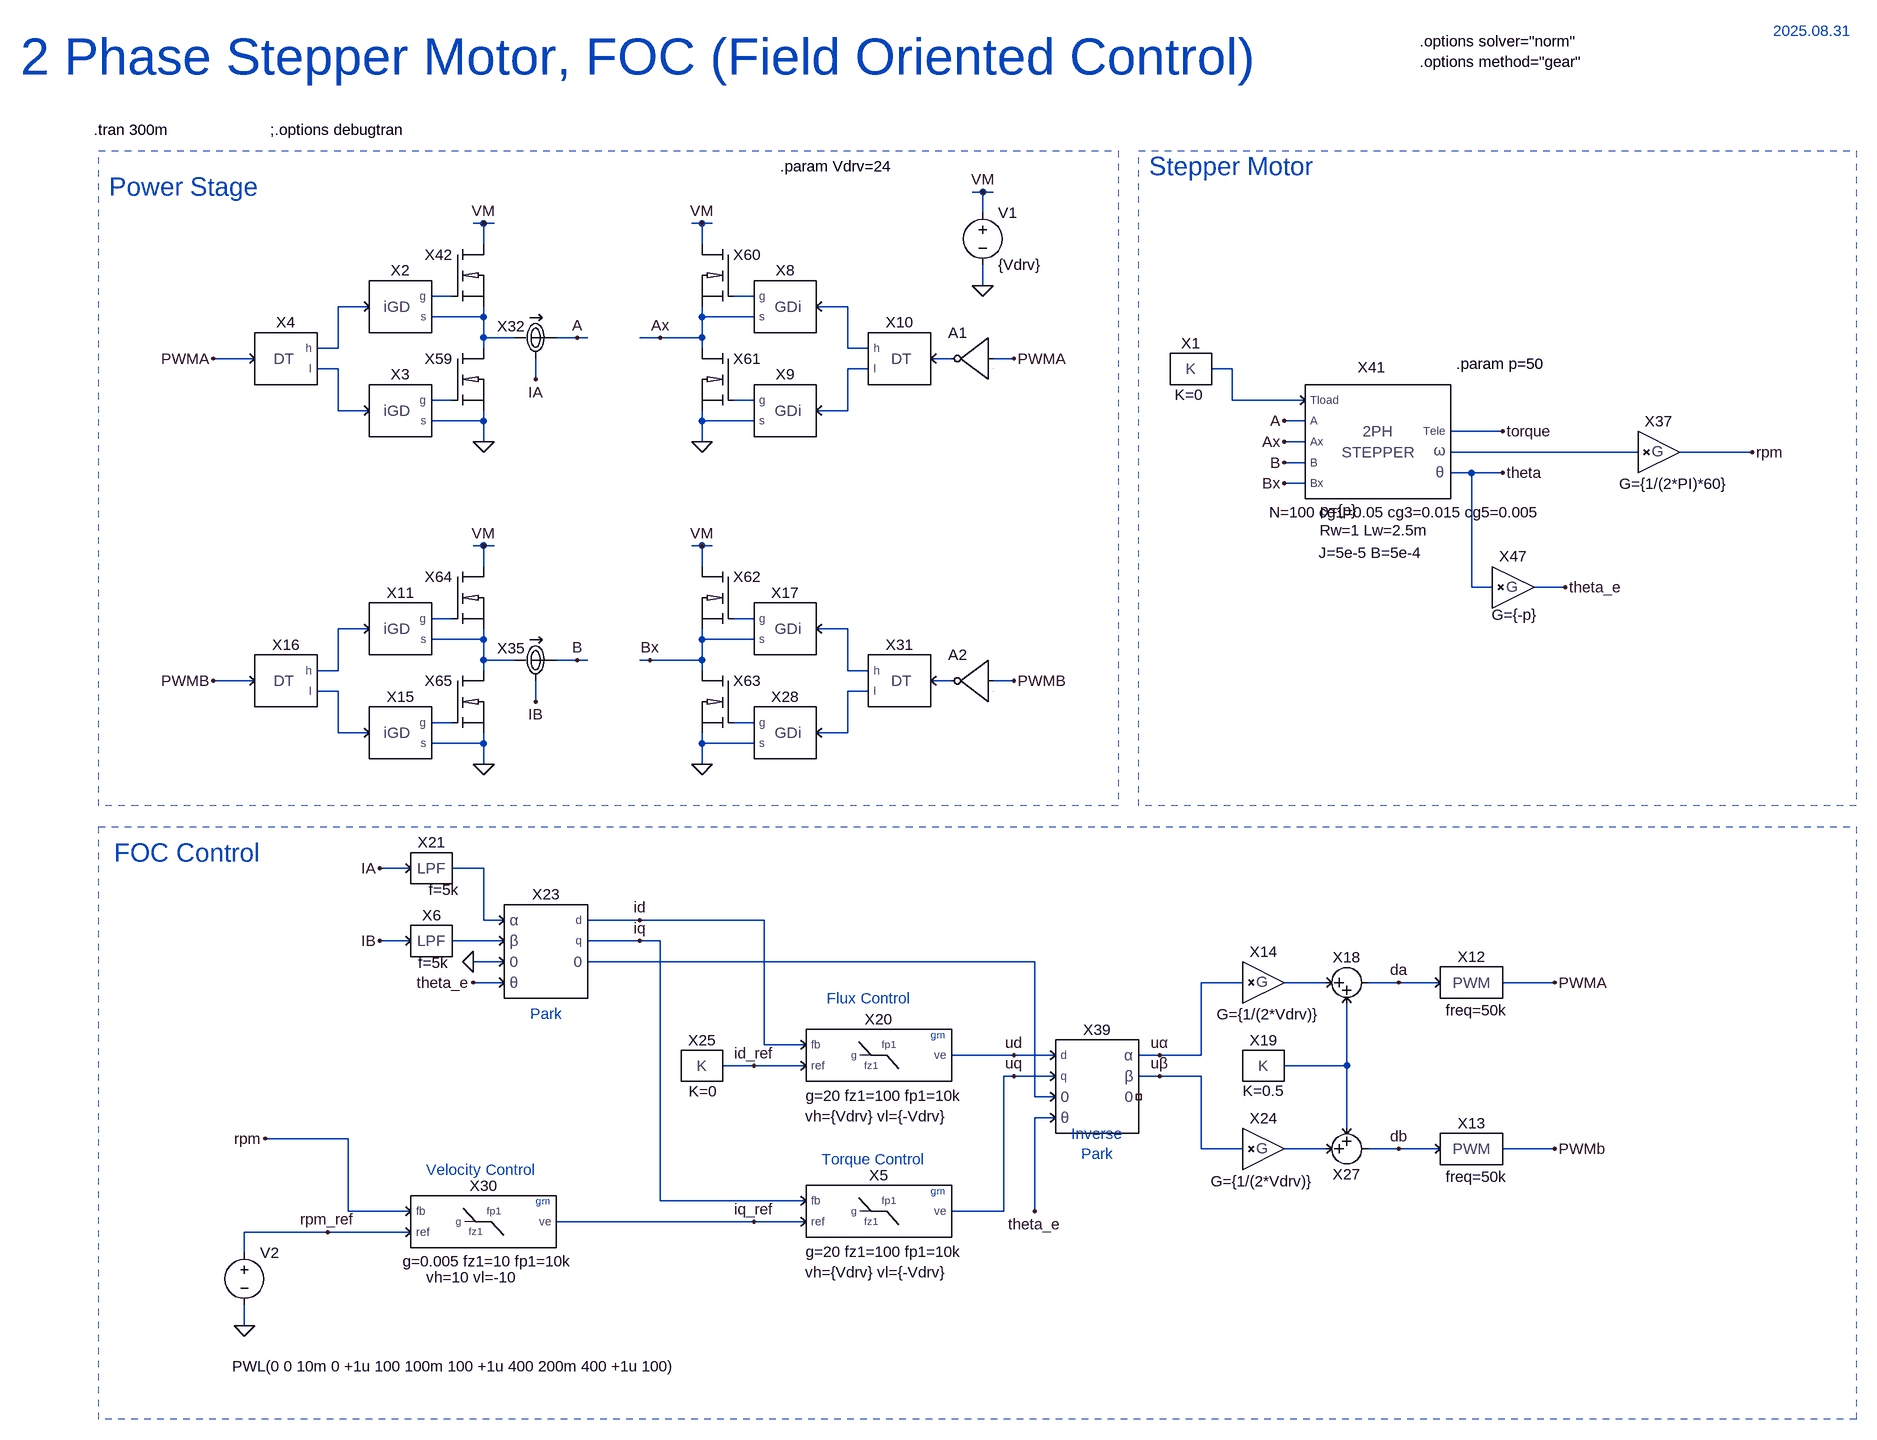
[diagram p0: schematic STEP2PH_FOC.asc]
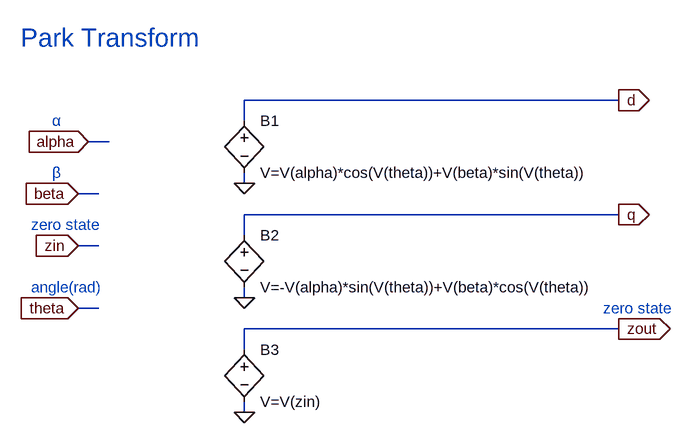
[diagram p1: sub-circuit park.asc]
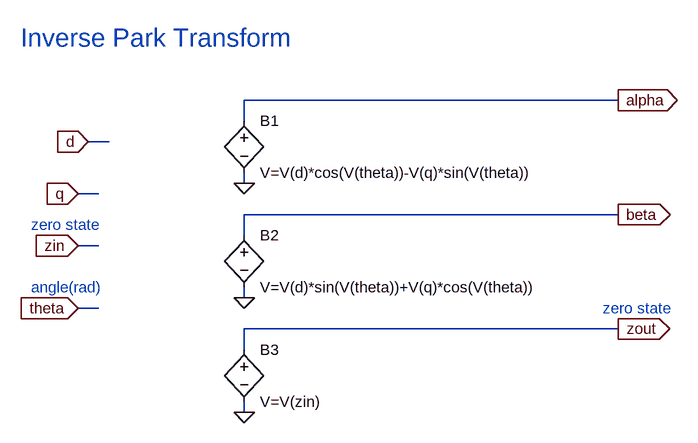
[diagram p2: sub-circuit parkinv.asc]
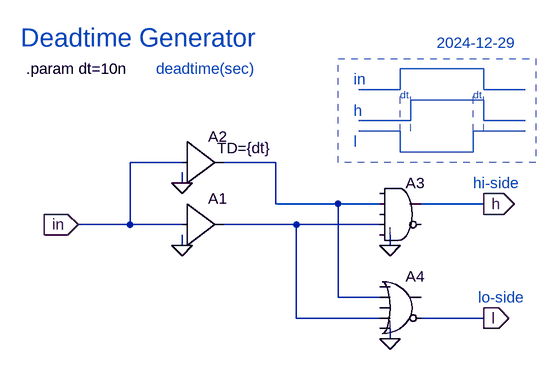
[diagram p3: sub-circuit deadtime.asc]
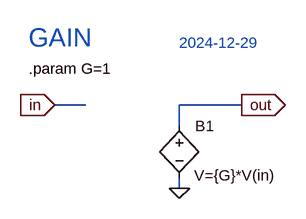
[diagram p4: sub-circuit gain.asc]
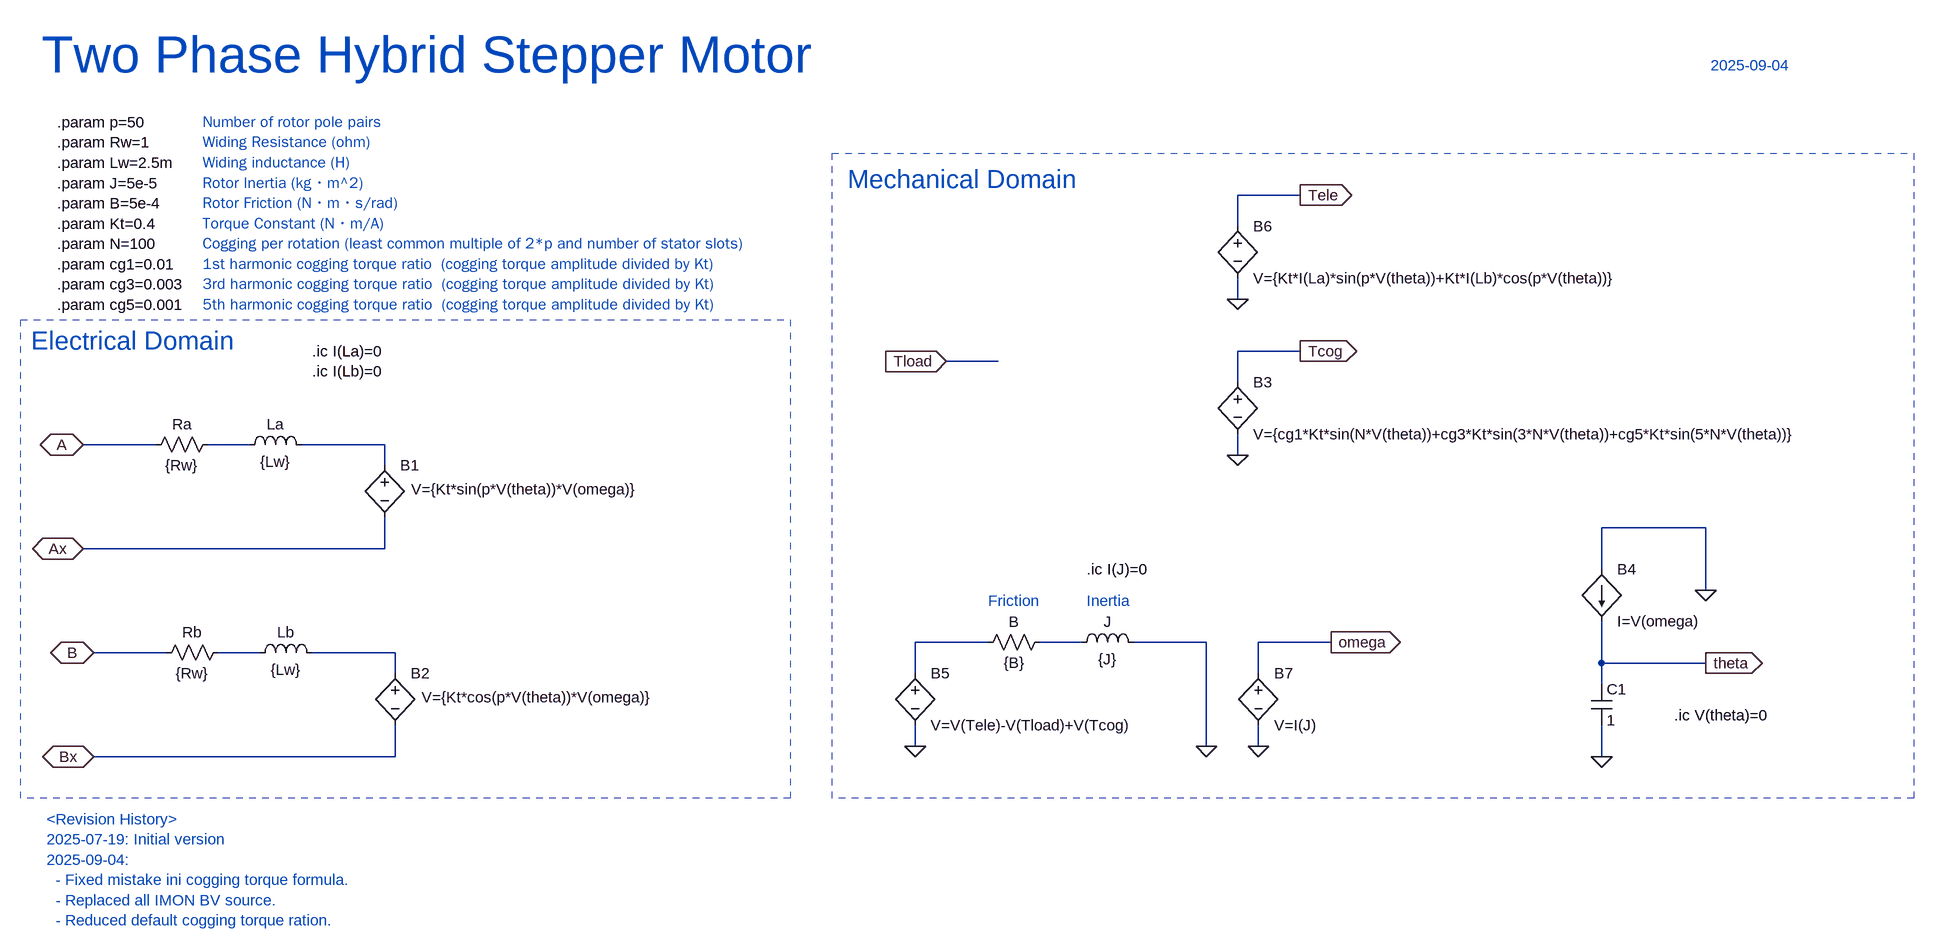
[diagram p5: sub-circuit stepper_2ph.asc]
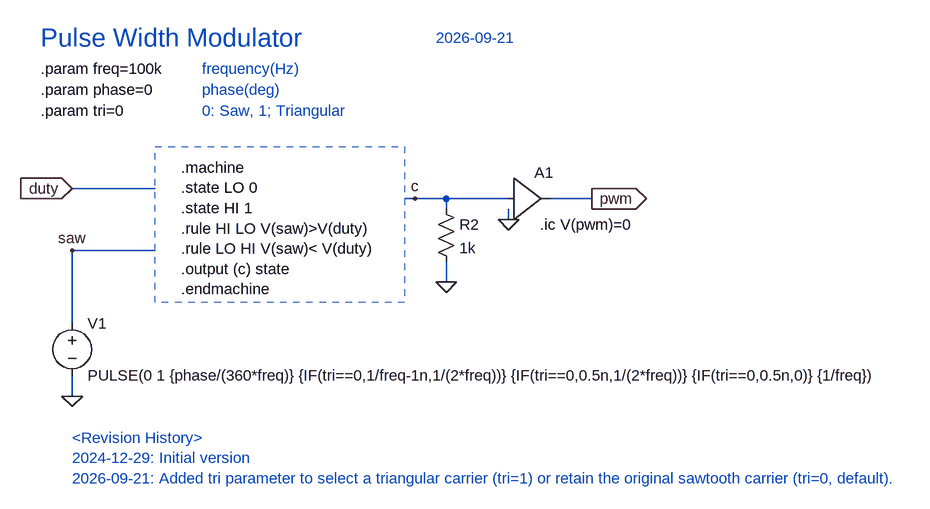
[diagram p6: sub-circuit pwm.asc]
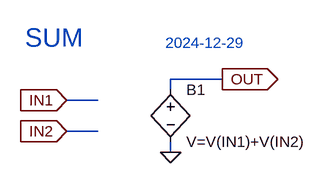
[diagram p7: sub-circuit sum.asc]
STEP2PH_FOC.asc, the LTspice schematic file:
Version 4.1
SHEET 1 5204 2604
WIRE 3856 -144 3840 -144
WIRE 3872 -144 3856 -144
WIRE 3856 -112 3856 -144
WIRE 3088 -96 3072 -96
WIRE 3104 -96 3088 -96
WIRE 3424 -96 3408 -96
WIRE 3440 -96 3424 -96
WIRE 3088 -64 3088 -96
WIRE 3424 -64 3424 -96
WIRE 3856 0 3856 -32
WIRE 3040 16 3008 16
WIRE 3504 16 3472 16
WIRE 2912 32 2864 32
WIRE 3648 32 3600 32
WIRE 3088 48 3088 32
WIRE 3088 48 3008 48
WIRE 3424 48 3424 32
WIRE 3504 48 3424 48
WIRE 3088 80 3088 48
WIRE 3136 80 3088 80
WIRE 3232 80 3200 80
WIRE 3248 80 3232 80
WIRE 3360 80 3328 80
WIRE 3424 80 3424 48
WIRE 3424 80 3360 80
WIRE 2864 96 2864 32
WIRE 2864 96 2832 96
WIRE 3088 96 3088 80
WIRE 3424 96 3424 80
WIRE 3648 96 3648 32
WIRE 3680 96 3648 96
WIRE 2736 112 2672 112
WIRE 3808 112 3776 112
WIRE 3904 112 3872 112
WIRE 2864 128 2832 128
WIRE 3680 128 3648 128
WIRE 4240 128 4208 128
WIRE 3168 144 3168 112
WIRE 3040 176 3008 176
WIRE 3504 176 3472 176
WIRE 4240 176 4240 128
WIRE 4352 176 4240 176
WIRE 2864 192 2864 128
WIRE 2912 192 2864 192
WIRE 3648 192 3648 128
WIRE 3648 192 3600 192
WIRE 3088 208 3088 192
WIRE 3088 208 3008 208
WIRE 3424 208 3424 192
WIRE 3504 208 3424 208
WIRE 4352 208 4320 208
WIRE 4656 224 4576 224
WIRE 3088 240 3088 208
WIRE 3424 240 3424 208
WIRE 4352 240 4320 240
WIRE 4864 256 4576 256
WIRE 5040 256 4928 256
WIRE 4352 272 4320 272
WIRE 4608 288 4576 288
WIRE 4656 288 4608 288
WIRE 4352 304 4320 304
WIRE 3088 400 3072 400
WIRE 3104 400 3088 400
WIRE 3424 400 3408 400
WIRE 3440 400 3424 400
WIRE 3088 432 3088 400
WIRE 3424 432 3424 400
WIRE 4608 464 4608 288
WIRE 4640 464 4608 464
WIRE 4752 464 4704 464
WIRE 3040 512 3008 512
WIRE 3504 512 3472 512
WIRE 2912 528 2864 528
WIRE 3648 528 3600 528
WIRE 3088 544 3088 528
WIRE 3088 544 3008 544
WIRE 3424 544 3424 528
WIRE 3504 544 3424 544
WIRE 3088 576 3088 544
WIRE 3136 576 3088 576
WIRE 3232 576 3200 576
WIRE 3248 576 3232 576
WIRE 3344 576 3328 576
WIRE 3424 576 3424 544
WIRE 3424 576 3344 576
WIRE 2864 592 2864 528
WIRE 2864 592 2832 592
WIRE 3088 592 3088 576
WIRE 3424 592 3424 576
WIRE 3648 592 3648 528
WIRE 3680 592 3648 592
WIRE 2736 608 2672 608
WIRE 3808 608 3776 608
WIRE 3904 608 3872 608
WIRE 2864 624 2832 624
WIRE 3680 624 3648 624
WIRE 3168 640 3168 608
WIRE 3040 672 3008 672
WIRE 3504 672 3472 672
WIRE 2864 688 2864 624
WIRE 2912 688 2864 688
WIRE 3648 688 3648 624
WIRE 3648 688 3600 688
WIRE 3088 704 3088 688
WIRE 3088 704 3008 704
WIRE 3424 704 3424 688
WIRE 3504 704 3424 704
WIRE 3088 736 3088 704
WIRE 3424 736 3424 704
WIRE 2976 896 2928 896
WIRE 3088 896 3040 896
WIRE 3088 976 3088 896
WIRE 3120 976 3088 976
WIRE 3328 976 3248 976
WIRE 3520 976 3328 976
WIRE 2976 1008 2928 1008
WIRE 3120 1008 3040 1008
WIRE 3328 1008 3248 1008
WIRE 3360 1008 3328 1008
WIRE 3120 1040 3072 1040
WIRE 3936 1040 3248 1040
WIRE 3120 1072 3072 1072
WIRE 4256 1072 4192 1072
WIRE 4384 1072 4320 1072
WIRE 4496 1072 4448 1072
WIRE 4560 1072 4496 1072
WIRE 4736 1072 4656 1072
WIRE 3520 1168 3520 976
WIRE 3584 1168 3520 1168
WIRE 3904 1184 3808 1184
WIRE 3968 1184 3904 1184
WIRE 4128 1184 4096 1184
WIRE 4192 1184 4192 1072
WIRE 4192 1184 4128 1184
WIRE 3504 1200 3456 1200
WIRE 3584 1200 3504 1200
WIRE 4416 1200 4416 1104
WIRE 4416 1200 4320 1200
WIRE 3904 1216 3888 1216
WIRE 3968 1216 3904 1216
WIRE 4128 1216 4096 1216
WIRE 4192 1216 4128 1216
WIRE 3936 1248 3936 1040
WIRE 3968 1248 3936 1248
WIRE 3968 1280 3936 1280
WIRE 4416 1296 4416 1200
WIRE 2880 1312 2752 1312
WIRE 4192 1328 4192 1216
WIRE 4256 1328 4192 1328
WIRE 4384 1328 4320 1328
WIRE 4496 1328 4448 1328
WIRE 4560 1328 4496 1328
WIRE 4736 1328 4656 1328
WIRE 3360 1408 3360 1008
WIRE 3584 1408 3360 1408
WIRE 2880 1424 2880 1312
WIRE 2976 1424 2880 1424
WIRE 3888 1424 3888 1216
WIRE 3888 1424 3808 1424
WIRE 3936 1424 3936 1280
WIRE 3504 1440 3200 1440
WIRE 3584 1440 3504 1440
WIRE 2848 1456 2720 1456
WIRE 2976 1456 2848 1456
WIRE 2720 1488 2720 1456
WIRE 2720 1600 2720 1568
FLAG 3504 1200 id_ref
FLAG 3328 976 id
FLAG 3328 1008 iq
FLAG 3072 1072 theta_e
FLAG 3936 1424 theta_e
FLAG 4656 288 theta
FLAG 3088 240 0
FLAG 3232 80 A
FLAG 4320 240 Ax
FLAG 4320 304 Bx
FLAG 3088 -96 VM
FLAG 3424 240 0
FLAG 3360 80 Ax
FLAG 3424 -96 VM
FLAG 2672 112 PWMA
FLAG 3904 112 PWMA
FLAG 4656 224 torque
FLAG 3088 736 0
FLAG 3232 576 B
FLAG 3088 400 VM
FLAG 3424 736 0
FLAG 3344 576 Bx
FLAG 3424 400 VM
FLAG 2672 608 PWMB
FLAG 3904 608 PWMB
FLAG 3856 0 0
FLAG 3856 -144 VM
FLAG 3168 144 IA
FLAG 3168 640 IB
FLAG 4320 208 A
FLAG 4320 272 B
FLAG 5040 256 rpm
FLAG 3072 1040 0
FLAG 2928 896 IA
FLAG 2928 1008 IB
FLAG 4736 1072 PWMA
FLAG 4736 1328 PWMb
FLAG 4128 1184 uα
FLAG 4128 1216 uβ
FLAG 3904 1184 ud
FLAG 3904 1216 uq
FLAG 4752 464 theta_e
FLAG 4496 1072 da
FLAG 4496 1328 db
FLAG 2848 1456 rpm_ref
FLAG 2752 1312 rpm
FLAG 3504 1440 iq_ref
FLAG 2720 1600 0
SYMBOL CONST 3424 1200 R0
WINDOW 39 1 55 Bottom 2
SYMATTR SpiceLine K=0
SYMATTR InstName X25
SYMBOL PowerSim\\PARK 3184 1024 R0
SYMATTR InstName X23
SYMBOL PowerSim\\PARKinv 4032 1232 R0
SYMATTR InstName X39
SYMBOL CONST 4176 128 R0
WINDOW 39 -3 55 Bottom 2
SYMATTR SpiceLine K=0
SYMATTR InstName X1
SYMBOL iGD 2960 32 R0
SYMATTR InstName X2
SYMBOL iGD 2960 192 R0
SYMATTR InstName X3
SYMBOL DEADTIME 2784 112 R0
SYMATTR InstName X4
SYMBOL iGD 3552 32 M0
SYMATTR InstName X8
SYMBOL iGD 3552 192 M0
SYMATTR InstName X9
SYMBOL DEADTIME 3728 112 M0
SYMATTR InstName X10
SYMBOL Digital\\inv 3872 48 M0
WINDOW 3 -21 103 Left 2
SYMATTR InstName A1
SYMBOL iGD 2960 528 R0
SYMATTR InstName X11
SYMBOL iGD 2960 688 R0
SYMATTR InstName X15
SYMBOL DEADTIME 2784 608 R0
SYMATTR InstName X16
SYMBOL iGD 3552 528 M0
SYMATTR InstName X17
SYMBOL iGD 3552 688 M0
SYMATTR InstName X28
SYMBOL DEADTIME 3728 608 M0
SYMATTR InstName X31
SYMBOL voltage 3856 -128 R0
SYMATTR InstName V1
SYMATTR Value {Vdrv}
SYMBOL IMON 3168 80 R0
SYMATTR InstName X32
SYMBOL IMON 3168 576 R0
SYMATTR InstName X35
SYMBOL Digital\\inv 3872 544 M0
WINDOW 3 -21 103 Left 2
SYMATTR InstName A2
SYMBOL GAIN 4896 256 R0
WINDOW 39 23 64 Bottom 2
SYMATTR SpiceLine G={1/(2*PI)*60}
SYMATTR InstName X37
SYMBOL STEPPER_2PH 4464 240 R0
WINDOW 3 -60 121 Bottom 2
WINDOW 123 -6 152 Bottom 2
WINDOW 39 -11 186 Bottom 2
WINDOW 40 43 124 Bottom 2
WINDOW 0 -10 -99 Bottom 2
SYMATTR Value p={p}
SYMATTR InstName X41
SYMBOL iNMOS 3088 -16 R0
SYMATTR InstName X42
SYMBOL iNMOS 3088 144 R0
SYMATTR InstName X59
SYMBOL iNMOS 3424 -16 M0
SYMATTR InstName X60
SYMBOL iNMOS 3424 144 M0
SYMATTR InstName X61
SYMBOL iNMOS 3424 480 M0
SYMATTR InstName X62
SYMBOL iNMOS 3424 640 M0
SYMATTR InstName X63
SYMBOL iNMOS 3088 480 R0
SYMATTR InstName X64
SYMBOL iNMOS 3088 640 R0
SYMATTR InstName X65
SYMBOL GAIN 4672 464 R0
WINDOW 39 3 58 Bottom 2
SYMATTR SpiceLine G={-p}
SYMATTR InstName X47
SYMBOL PWM 4608 1072 R0
WINDOW 39 8 58 Bottom 2
SYMATTR SpiceLine freq=50k
SYMATTR InstName X12
SYMBOL PWM 4608 1328 R0
WINDOW 39 8 58 Bottom 2
SYMATTR SpiceLine freq=50k
SYMATTR InstName X13
SYMBOL GAIN 4288 1072 R0
WINDOW 39 7 64 Bottom 2
SYMATTR SpiceLine G={1/(2*Vdrv)}
SYMATTR InstName X14
SYMBOL SUM 4416 1072 R0
SYMATTR InstName X18
SYMBOL CONST 4288 1200 R0
WINDOW 39 0 54 Bottom 2
SYMATTR SpiceLine K=0.5
SYMATTR InstName X19
SYMBOL GAIN 4288 1328 R0
WINDOW 39 -2 65 Bottom 2
SYMATTR SpiceLine G={1/(2*Vdrv)}
SYMATTR InstName X24
SYMBOL SUM 4416 1328 M180
SYMATTR InstName X27
SYMBOL LPF 3008 896 R0
WINDOW 3 19 49 Bottom 2
SYMATTR Value f=5k
SYMATTR InstName X21
SYMBOL TYPE2_gm 3088 1440 R0
WINDOW 39 7 76 Bottom 2
WINDOW 40 -18 101 Bottom 2
SYMATTR SpiceLine g=0.005 fz1=10 fp1=10k
SYMATTR SpiceLine2 vh=10 vl=-10
SYMATTR InstName X30
SYMBOL TYPE2_gm 3696 1184 R0
WINDOW 39 9 78 Bottom 2
WINDOW 40 -4 109 Bottom 2
SYMATTR SpiceLine g=20 fz1=100 fp1=10k
SYMATTR SpiceLine2 vh={Vdrv} vl={-Vdrv}
SYMATTR InstName X20
SYMBOL TYPE2_gm 3696 1424 R0
WINDOW 39 9 78 Bottom 2
WINDOW 40 -4 109 Bottom 2
SYMATTR SpiceLine g=20 fz1=100 fp1=10k
SYMATTR SpiceLine2 vh={Vdrv} vl={-Vdrv}
SYMATTR InstName X5
SYMBOL voltage 2720 1472 R0
WINDOW 123 0 0 Left 0
WINDOW 39 0 0 Left 0
WINDOW 3 -19 190 Left 2
SYMATTR Value PWL(0 0 10m 0 +1u 100 100m 100 +1u 400 200m 400 +1u 100)
SYMATTR InstName V2
SYMBOL LPF 3008 1008 R0
WINDOW 3 3 49 Bottom 2
SYMATTR Value f=5k
SYMATTR InstName X6
TEXT 3160 1120 Left 2 ;Park
TEXT 4032 1320 Center 2 ;Inverse\nPark
TEXT 2488 -240 Left 2 !.tran 300m
TEXT 4528 -376 Left 2 !.options solver="norm"\n.options method="gear"
TEXT 4584 120 Left 2 !.param p=50
TEXT 2376 -352 Left 6 ;2 Phase Stepper Motor, FOC (Field Oriented Control)
TEXT 4112 -184 Left 4 ;Stepper Motor
TEXT 5072 -392 Left 2 ;2025.08.31
TEXT 2512 -152 Left 4 ;Power Stage
TEXT 3608 1344 Left 2 ;Torque Control
TEXT 3616 1096 Left 2 ;Flux Control
TEXT 2760 -240 Left 2 !;.options debugtran
TEXT 3000 1360 Left 2 ;Velocity Control
TEXT 3544 -184 Left 2 !.param Vdrv=24
TEXT 2520 872 Left 4 ;FOC Control
TEXT 3776 1152 Left 1 ;gm
TEXT 3776 1392 Left 1 ;gm
TEXT 3168 1408 Left 1 ;gm
RECTANGLE Normal 4064 800 2496 -208 2
RECTANGLE Normal 5200 800 4096 -208 2
RECTANGLE Normal 5200 1744 2496 832 2

park.asc, the sub-circuit schematic file:
Version 4
SHEET 1 880 680
WIRE 592 96 16 96
WIRE 16 128 16 96
WIRE -192 160 -224 160
WIRE 16 224 16 208
WIRE -208 240 -240 240
WIRE 592 272 16 272
WIRE 16 304 16 272
WIRE -208 320 -240 320
WIRE 16 400 16 384
WIRE -208 416 -240 416
WIRE 592 448 16 448
WIRE 16 480 16 448
WIRE 16 576 16 560
FLAG 16 224 0
FLAG 592 96 d
IOPIN 592 96 Out
FLAG -224 160 alpha
IOPIN -224 160 In
FLAG -240 320 zin
IOPIN -240 320 In
FLAG 16 400 0
FLAG 592 272 q
IOPIN 592 272 Out
FLAG 16 576 0
FLAG 592 448 zout
IOPIN 592 448 Out
FLAG -240 416 theta
IOPIN -240 416 In
FLAG -240 240 beta
IOPIN -240 240 In
SYMBOL bv 16 112 R0
SYMATTR InstName B1
SYMATTR Value V=V(alpha)*cos(V(theta))+V(beta)*sin(V(theta))
SYMBOL bv 16 288 R0
SYMATTR InstName B2
SYMATTR Value V=-V(alpha)*sin(V(theta))+V(beta)*cos(V(theta))
SYMBOL bv 16 464 R0
SYMATTR InstName B3
SYMATTR Value V=V(zin)
TEXT -328 0 Left 4 ;Park Transform
TEXT -280 128 Left 2 ;α
TEXT -280 208 Left 2 ;β
TEXT -312 288 Left 2 ;zero state
TEXT -312 384 Left 2 ;angle(rad)
TEXT 568 416 Left 2 ;zero state

parkinv.asc, the sub-circuit schematic file:
Version 4
SHEET 1 880 680
WIRE 592 96 16 96
WIRE 16 128 16 96
WIRE -192 160 -224 160
WIRE 16 224 16 208
WIRE -208 240 -240 240
WIRE 592 272 16 272
WIRE 16 304 16 272
WIRE -208 320 -240 320
WIRE 16 400 16 384
WIRE -208 416 -240 416
WIRE 592 448 16 448
WIRE 16 480 16 448
WIRE 16 576 16 560
FLAG 16 224 0
FLAG 592 96 alpha
IOPIN 592 96 Out
FLAG -224 160 d
IOPIN -224 160 In
FLAG -240 320 zin
IOPIN -240 320 In
FLAG 16 400 0
FLAG 592 272 beta
IOPIN 592 272 Out
FLAG 16 576 0
FLAG 592 448 zout
IOPIN 592 448 Out
FLAG -240 416 theta
IOPIN -240 416 In
FLAG -240 240 q
IOPIN -240 240 In
SYMBOL bv 16 112 R0
SYMATTR InstName B1
SYMATTR Value V=V(d)*cos(V(theta))-V(q)*sin(V(theta))
SYMBOL bv 16 288 R0
SYMATTR InstName B2
SYMATTR Value V=V(d)*sin(V(theta))+V(q)*cos(V(theta))
SYMBOL bv 16 464 R0
SYMATTR InstName B3
SYMATTR Value V=V(zin)
TEXT -328 0 Left 4 ;Inverse Park Transform
TEXT -312 288 Left 2 ;zero state
TEXT -312 384 Left 2 ;angle(rad)
TEXT 568 416 Left 2 ;zero state

deadtime.asc, the sub-circuit schematic file:
Version 4
SHEET 1 1412 1312
WIRE 64 288 -16 288
WIRE 208 288 128 288
WIRE 64 320 64 304
WIRE 208 352 208 288
WIRE 304 352 208 352
WIRE 368 352 304 352
WIRE 528 352 432 352
WIRE -16 384 -16 288
WIRE -16 384 -96 384
WIRE 64 384 -16 384
WIRE 240 384 128 384
WIRE 368 384 240 384
WIRE 64 416 64 400
WIRE 384 416 384 400
WIRE 304 496 304 352
WIRE 368 496 304 496
WIRE 240 528 240 384
WIRE 368 528 240 528
WIRE 528 528 432 528
WIRE 384 560 384 544
FLAG -96 384 in
IOPIN -96 384 In
FLAG 64 416 0
FLAG 64 320 0
FLAG 384 416 0
FLAG 384 560 0
FLAG 528 352 h
IOPIN 528 352 Out
FLAG 528 528 l
IOPIN 528 528 Out
SYMBOL Digital\\buf1 64 320 R0
SYMATTR InstName A1
SYMBOL Digital\\buf1 64 224 R0
WINDOW 3 54 42 Left 2
SYMATTR Value TD={dt}
SYMATTR InstName A2
SYMBOL Digital\\and 400 304 R0
SYMATTR InstName A3
SYMBOL Digital\\or 400 448 R0
SYMATTR InstName A4
TEXT -176 144 Left 2 !.param dt=10n
TEXT -184 96 Left 4 ;Deadtime Generator
TEXT 24 144 Left 2 ;deadtime(sec)
TEXT 512 320 Left 2 ;hi-side
TEXT 520 496 Left 2 ;lo-side
TEXT 328 160 Left 2 ;in
TEXT 328 208 Left 2 ;h
TEXT 328 256 Left 2 ;l
TEXT 400 184 Left 1 ;dt
TEXT 512 184 Left 1 ;dt
TEXT 456 104 Left 2 ;2024-12-29
LINE Normal 400 176 336 176
LINE Normal 400 176 400 144
LINE Normal 528 144 400 144
LINE Normal 528 176 528 144
LINE Normal 592 176 528 176
LINE Normal 416 224 336 224
LINE Normal 416 224 416 192
LINE Normal 528 192 416 192
LINE Normal 528 224 528 192
LINE Normal 592 224 528 224
LINE Normal 400 240 336 240
LINE Normal 400 272 400 240
LINE Normal 512 272 400 272
LINE Normal 512 272 512 240
LINE Normal 592 240 512 240
LINE Normal 400 240 400 176 2
LINE Normal 512 240 512 176 2
LINE Normal 416 240 416 176 2
LINE Normal 528 240 528 176 2
RECTANGLE Normal 608 288 304 128 2

gain.asc, the sub-circuit schematic file:
Version 4
SHEET 1 880 680
WIRE 0 64 -48 64
WIRE 240 64 144 64
WIRE 144 96 144 64
WIRE 144 192 144 176
FLAG 144 192 0
FLAG 240 64 out
IOPIN 240 64 Out
FLAG -48 64 in
IOPIN -48 64 In
SYMBOL bv 144 80 R0
WINDOW 3 23 92 Left 2
SYMATTR Value V={G}*V(in)
SYMATTR InstName B1
TEXT -88 8 Left 2 !.param G=1
TEXT -88 -40 Left 4 ;GAIN
TEXT 144 -32 Left 2 ;2024-12-29

stepper_2ph.asc, the sub-circuit schematic file:
Version 4.1
SHEET 1 2756 2296
WIRE 1808 256 1712 256
WIRE 1712 304 1712 256
WIRE 1712 416 1712 384
WIRE 1808 496 1712 496
WIRE 1344 512 1264 512
WIRE 1712 544 1712 496
WIRE 48 640 -64 640
WIRE 192 640 128 640
WIRE 400 640 272 640
WIRE 1712 656 1712 624
WIRE 400 672 400 640
WIRE 2432 768 2272 768
WIRE 400 800 400 752
WIRE 400 800 -64 800
WIRE 2272 832 2272 768
WIRE 2432 864 2432 768
WIRE 1328 944 1216 944
WIRE 1472 944 1408 944
WIRE 1664 944 1552 944
WIRE 1856 944 1744 944
WIRE 64 960 -48 960
WIRE 208 960 144 960
WIRE 416 960 288 960
WIRE 2272 976 2272 912
WIRE 2432 976 2272 976
WIRE 416 992 416 960
WIRE 1216 992 1216 944
WIRE 1744 992 1744 944
WIRE 2272 1008 2272 976
WIRE 1216 1104 1216 1072
WIRE 1664 1104 1664 944
WIRE 1744 1104 1744 1072
WIRE 416 1120 416 1072
WIRE 416 1120 -48 1120
WIRE 2272 1120 2272 1072
FLAG 1712 656 0
FLAG 1216 1104 0
FLAG 2272 1120 0
FLAG 1264 512 Tload
IOPIN 1264 512 In
FLAG -64 640 A
IOPIN -64 640 BiDir
FLAG -64 800 Ax
IOPIN -64 800 BiDir
FLAG -48 960 B
IOPIN -48 960 BiDir
FLAG -48 1120 Bx
IOPIN -48 1120 BiDir
FLAG 2432 976 theta
IOPIN 2432 976 Out
FLAG 1808 496 Tcog
IOPIN 1808 496 Out
FLAG 1664 1104 0
FLAG 2432 864 0
FLAG 1712 416 0
FLAG 1808 256 Tele
IOPIN 1808 256 Out
FLAG 1744 1104 0
FLAG 1856 944 omega
IOPIN 1856 944 Out
SYMBOL res 144 624 R90
WINDOW 0 0 56 VBottom 2
WINDOW 3 32 56 VTop 2
SYMATTR InstName Ra
SYMATTR Value {Rw}
SYMBOL ind 176 656 R270
WINDOW 0 32 56 VTop 2
WINDOW 3 5 56 VBottom 2
SYMATTR InstName La
SYMATTR Value {Lw}
SYMBOL res 160 944 R90
WINDOW 0 0 56 VBottom 2
WINDOW 3 32 56 VTop 2
SYMATTR InstName Rb
SYMATTR Value {Rw}
SYMBOL ind 192 976 R270
WINDOW 0 32 56 VTop 2
WINDOW 3 5 56 VBottom 2
SYMATTR InstName Lb
SYMATTR Value {Lw}
SYMBOL bv 416 976 R0
WINDOW 3 41 53 Left 2
SYMATTR Value V={Kt*cos(p*V(theta))*V(omega)}
SYMATTR InstName B2
SYMBOL bv 1712 528 R0
SYMATTR InstName B3
SYMATTR Value V={cg1*Kt*sin(N*V(theta))+cg3*Kt*sin(3*N*V(theta))+cg5*Kt*sin(5*N*V(theta))}
SYMBOL ind 1456 960 R270
WINDOW 0 32 56 VTop 2
WINDOW 3 5 56 VBottom 2
SYMATTR InstName J
SYMATTR Value {J}
SYMBOL bv 1216 976 R0
SYMATTR InstName B5
SYMATTR Value V=V(Tele)-V(Tload)+V(Tcog)
SYMBOL cap 2256 1008 R0
SYMATTR InstName C1
SYMATTR Value 1
SYMBOL res 1424 928 R90
WINDOW 0 0 56 VBottom 2
WINDOW 3 32 56 VTop 2
SYMATTR InstName B
SYMATTR Value {B}
SYMBOL bi 2272 832 R0
SYMATTR InstName B4
SYMATTR Value I=V(omega)
SYMBOL bv 400 656 R0
WINDOW 3 41 53 Left 2
SYMATTR Value V={Kt*sin(p*V(theta))*V(omega)}
SYMATTR InstName B1
SYMBOL bv 1712 288 R0
SYMATTR InstName B6
SYMATTR Value V={Kt*I(La)*sin(p*V(theta))+Kt*I(Lb)*cos(p*V(theta))}
SYMBOL bv 1744 976 R0
SYMATTR InstName B7
SYMATTR Value V=I(J)
TEXT -104 144 Left 2 !.param p=50\n.param Rw=1\n.param Lw=2.5m\n.param J=5e-5\n.param B=5e-4\n.param Kt=0.4\n.param N=100\n.param cg1=0.01\n.param cg3=0.003\n.param cg5=0.001
TEXT -128 40 Left 6 ;Two Phase Hybrid Stepper Motor
TEXT 2440 56 Left 2 ;2025-09-04
TEXT 2384 1056 Left 2 !.ic V(theta)=0
TEXT 1480 832 Left 2 !.ic I(J)=0
TEXT 1480 880 Left 2 ;Inertia
TEXT 1328 880 Left 2 ;Friction
TEXT 288 496 Left 2 !.ic I(La)=0\n.ic I(Lb)=0
TEXT 120 144 Left 2 ;Number of rotor pole pairs\nWiding Resistance (ohm)\nWiding inductance (H)\nRotor Inertia (kg・m^2)\nRotor Friction (N・m・s/rad)\nTorque Constant (N・m/A)\nCogging per rotation (least common multiple of 2*p and number of stator slots)\n1st harmonic cogging torque ratio  (cogging torque amplitude divided by Kt)\n3rd harmonic cogging torque ratio  (cogging torque amplitude divided by Kt)\n5th harmonic cogging torque ratio  (cogging torque amplitude divided by Kt)
TEXT -120 1216 Left 2 ;<Revision History>\n2025-07-19: Initial version\n2025-09-04: \n  - Fixed mistake ini cogging torque formula.\n  - Replaced all IMON BV source.\n  - Reduced default cogging torque ration.
TEXT -144 480 Left 4 ;Electrical Domain
TEXT 1112 232 Left 4 ;Mechanical Domain
RECTANGLE Normal 1024 1184 -160 448 2
RECTANGLE Normal 2752 1184 1088 192 2

pwm.asc, the sub-circuit schematic file:
Version 4.1
SHEET 1 1668 1312
WIRE 32 64 -96 64
WIRE 432 80 416 80
WIRE 480 80 432 80
WIRE 576 80 480 80
WIRE 704 80 640 80
WIRE 480 96 480 80
WIRE 576 112 576 96
WIRE 32 160 -96 160
WIRE 480 208 480 176
WIRE -96 272 -96 160
WIRE -96 384 -96 352
FLAG -96 64 duty
IOPIN -96 64 In
FLAG 704 80 pwm
IOPIN 704 80 Out
FLAG 480 208 0
FLAG 432 80 c
FLAG 576 112 0
FLAG -96 384 0
FLAG -96 160 saw
SYMBOL res 464 80 R0
SYMATTR InstName R2
SYMATTR Value 1k
SYMBOL Digital\\buf1 576 16 R0
SYMATTR InstName A1
SYMBOL voltage -96 256 R0
WINDOW 123 0 0 Left 0
WINDOW 39 0 0 Left 0
SYMATTR InstName V1
SYMATTR Value PULSE(0 1 {phase/(360*freq)} {IF(tri==0,1/freq-1n,1/(2*freq))} {IF(tri==0,0.5n,1/(2*freq))} {IF(tri==0,0.5n,0)} {1/freq})
TEXT 72 32 Left 2 !.machine\n.state LO 0\n.state HI 1\n.rule HI LO V(saw)>V(duty)\n.rule LO HI V(saw)< V(duty)\n.output (c) state\n.endmachine
TEXT -144 -120 Left 2 !.param freq=100k
TEXT 624 120 Left 2 !.ic V(pwm)=0
TEXT -144 -88 Left 2 !.param phase=0
TEXT -144 -168 Left 4 ;Pulse Width Modulator
TEXT 464 -168 Left 2 ;2026-09-21
TEXT 104 -120 Left 2 ;frequency(Hz)
TEXT -144 -56 Left 2 !.param tri=0
TEXT 104 -56 Left 2 ;0: Saw, 1; Triangular
TEXT 104 -88 Left 2 ;phase(deg)
TEXT -96 448 Left 2 ;<Revision History>\n2024-12-29: Initial version\n2026-09-21: Added tri parameter to select a triangular carrier (tri=1) or retain the original sawtooth carrier (tri=0, default).
RECTANGLE Normal 416 240 32 0 2

sum.asc, the sub-circuit schematic file:
Version 4
SHEET 1 880 680
WIRE 288 96 208 96
WIRE 208 112 208 96
WIRE 96 128 48 128
WIRE 96 176 48 176
WIRE 208 208 208 192
FLAG 48 128 IN1
IOPIN 48 128 In
FLAG 48 176 IN2
IOPIN 48 176 In
FLAG 208 208 0
FLAG 288 96 OUT
IOPIN 288 96 Out
SYMBOL bv 208 96 R0
SYMATTR InstName B1
SYMATTR Value V=V(IN1)+V(IN2)
TEXT -16 32 Left 4 ;SUM
TEXT 200 40 Left 2 ;2024-12-29

lpf.asc, the sub-circuit schematic file:
Version 4.1
SHEET 1 1652 804
WIRE 944 -80 848 -80
WIRE 192 -48 80 -48
WIRE 304 -48 272 -48
WIRE 384 -48 304 -48
WIRE 688 -48 464 -48
WIRE 80 -32 80 -48
WIRE 304 -32 304 -48
WIRE 464 -32 464 -48
WIRE 848 -16 848 -80
WIRE -96 0 -160 0
WIRE 304 48 304 32
WIRE 464 64 464 48
WIRE 80 80 80 48
WIRE 848 112 848 64
WIRE 192 288 192 256
WIRE 192 288 128 288
WIRE 256 288 192 288
WIRE 496 288 496 256
WIRE 496 288 432 288
WIRE 560 288 496 288
WIRE 192 320 192 288
WIRE 256 320 256 288
WIRE 432 320 432 288
WIRE 496 320 496 288
WIRE 560 320 560 288
WIRE 128 336 128 288
WIRE 128 480 128 416
WIRE 192 480 192 384
WIRE 256 480 256 400
WIRE 432 480 432 400
WIRE 496 480 496 384
WIRE 560 480 560 400
FLAG -160 0 in
IOPIN -160 0 In
FLAG 944 -80 out
IOPIN 944 -80 Out
FLAG 304 48 0
FLAG 80 80 0
FLAG 384 -48 a
FLAG 464 64 0
FLAG 848 112 0
FLAG 256 480 0
FLAG 192 256 v1
FLAG 496 256 v2
FLAG 128 480 0
FLAG 560 480 0
FLAG 688 -48 v0
FLAG 192 480 0
FLAG 496 480 0
FLAG 432 480 0
SYMBOL res 288 -64 R90
WINDOW 0 0 56 VBottom 2
WINDOW 3 32 56 VTop 2
SYMATTR InstName R1
SYMATTR Value 1k
SYMBOL cap 288 -32 R0
SYMATTR InstName C1
SYMATTR Value {Co}
SYMBOL bv 80 -48 R0
SYMATTR InstName B1
SYMATTR Value V=V(in)
SYMBOL bv 464 -48 R0
SYMATTR InstName B2
SYMATTR Value V=V(a)
SYMBOL bv 848 -32 R0
SYMATTR InstName B3
SYMATTR Value V=IF({n}==1,V(v0),V(v1))
SYMBOL res 240 304 R0
SYMATTR InstName R2
SYMATTR Value 1Gig
SYMBOL cap 176 320 R0
SYMATTR InstName C2
SYMATTR Value 1
SYMBOL bi 128 416 R180
WINDOW 0 24 80 Left 2
WINDOW 3 24 0 Left 2
SYMATTR InstName B5
SYMATTR Value I=V(v2)
SYMBOL res 448 304 M0
SYMATTR InstName R3
SYMATTR Value 1Gig
SYMBOL cap 512 320 M0
SYMATTR InstName C3
SYMATTR Value 1
SYMBOL bi 560 400 R180
WINDOW 3 -848 -5 Left 2
WINDOW 0 -56 82 Left 2
SYMATTR Value I={-(2*pi*f)*(2*pi*f)*V(v1)-(2*pi*f/q)*V(v2)+(2*pi*f)*(2*pi*f)*V(in)}
SYMATTR InstName B4
TEXT -264 -368 Left 4 ;1st/2nd order Low Pass Filter
TEXT 696 -368 Left 2 ;2025-12-26
TEXT -256 -304 Left 2 !.param f=100k\n.param n=1\n.param q=0.5
TEXT 328 -80 Left 2 !.param Co=1/({f}*2k*PI)
TEXT 0 -304 Left 2 ;cut off frequency\nfilter order (1:1st order, other: 2nd order)\nq factor (only for 2nd order)
TEXT -8 -112 Left 2 ;1st Order LPF
TEXT 8 160 Left 2 ;2nd Order LPF
TEXT -152 560 Left 2 ;<Revision History>\n2025-03-23: Initial version\n2025-12-26: \n -  Replaced LTspice built in 2ndOrderLPF with discrete circuit to improve convergence.\n -  Removed output MUX and replaced it with BV.
RECTANGLE Normal 752 112 -16 -96 2
RECTANGLE Normal 1440 512 -16 192 2

type2_gm.asc, the sub-circuit schematic file:
Version 4.1
SHEET 1 1136 680
WIRE 432 -144 432 -160
WIRE 544 -144 544 -160
WIRE 432 -48 432 -64
WIRE 544 -48 544 -64
WIRE -128 144 -128 112
WIRE 416 144 416 96
WIRE -336 176 -368 176
WIRE -336 256 -368 256
WIRE -128 272 -128 224
WIRE -128 272 -240 272
WIRE 0 272 -128 272
WIRE 416 272 416 208
WIRE 416 272 0 272
WIRE 640 272 416 272
WIRE -128 304 -128 272
WIRE -240 336 -240 272
WIRE 0 336 0 272
WIRE 416 352 416 272
WIRE -128 416 -128 384
WIRE 416 448 416 416
WIRE -240 496 -240 416
WIRE -128 496 -128 480
WIRE 0 496 0 400
FLAG 640 272 ve
IOPIN 640 272 Out
FLAG -128 496 0
FLAG -240 496 0
FLAG 0 496 0
FLAG -128 112 0
FLAG 544 -48 0
FLAG 432 -48 0
FLAG 432 -160 +V
FLAG 544 -160 -V
FLAG 416 448 -V
FLAG 416 96 +V
FLAG -368 176 fb
IOPIN -368 176 In
FLAG -368 256 ref
IOPIN -368 256 In
SYMBOL bi -128 144 R0
SYMATTR InstName B1
SYMATTR Value I=(limit(V(ref)-V(fb),{-Ilim},{Ilim}))
SYMBOL res -144 288 R0
SYMATTR InstName R1
SYMATTR Value {Rz1}
SYMBOL cap -144 416 R0
SYMATTR InstName C1
SYMATTR Value {Cz1}
SYMBOL res -256 320 R0
SYMATTR InstName R2
SYMATTR Value {avol}
SYMBOL cap -16 336 R0
SYMATTR InstName C2
SYMATTR Value {Co1}
SYMBOL diode 432 416 R180
WINDOW 0 24 64 Left 2
WINDOW 3 24 0 Left 2
SYMATTR InstName D1
SYMATTR Value myD
SYMBOL voltage 432 -160 R0
SYMATTR InstName V1
SYMATTR Value {vh}
SYMBOL voltage 544 -160 R0
WINDOW 123 0 0 Left 0
WINDOW 39 24 44 Left 2
SYMATTR InstName V2
SYMATTR Value {vl}
SYMBOL diode 432 208 R180
WINDOW 0 24 64 Left 2
WINDOW 3 24 0 Left 2
SYMATTR InstName D2
SYMATTR Value myD
TEXT -336 -224 Left 2 !.param g=1\n.param fz1=1k\n.param fp1=20k\n.param vh=5\n.param vl=0\n.param avol=100k
TEXT -352 -288 Left 4 ;Type 2 Compensator, Gm amp base
TEXT -104 -224 Left 2 ;target gain at fz1\nzero frequency(Hz)\npole frequency(Hz)\nmax ouput voltage(V)\nmin output voltage(V)\nopen loop gain
TEXT 808 -328 Left 2 ;2025-08-31
TEXT -56 24 Left 2 !.param Rz1={(g*avol)/(avol-g)}\n.param Cz1={1/(2*PI*fz1*Rz1)}\n.param Co1={1/(2*PI*fp1*Rz1)}
TEXT 488 312 Left 2 !.ic V(ve)=0
TEXT 480 440 Left 2 !.MODEL myD D(RON=1u ROFF=1G Vfwd=10n)
TEXT -88 184 Left 2 !.param Ilim=1000
TEXT 672 -184 Left 2 ;<Revision History>\n2025-08-31: Initial version
TEXT -416 144 Left 2 ;feedback
TEXT -416 216 Left 2 ;reference
TEXT 384 -288 Left 1 ;* TYPE2_gm is a Gm-amp based version of TYPE2.\n* Unlike the op-amp based TYPE2, it offers high input impedance at ref/fb\n* and is better suited for dynamic reference applications (e.g. soft-start,\n* motor speed control). Both models are kept for flexibility.
RECTANGLE Normal 992 -208 368 -304 2

The netlist it stands for:
* STEP2PH_FOC.asc
X§X25 id_ref CONST K=0  ; pins K
X§X23 N023 N024 theta_e 0 id iq N025 park
X§X39 ud uq theta_e N025 uα uβ NC_01 parkinv
X§X1 N009 CONST K=0  ; pins K
X§X2 N003 N001 N005 iGD  ; pins in g s
X§X3 N007 N010 0 iGD  ; pins in g s
X§X4 PWMA N007 N003 deadtime params: dt=10n
X§X8 N004 N002 Ax iGD  ; pins in g s
X§X9 N008 N011 0 iGD  ; pins in g s
X§X10 N006 N008 N004 deadtime params: dt=10n
A1 PWMA 0 0 0 0 N006 0 0 BUF
X§X11 N015 N013 N017 iGD  ; pins in g s
X§X15 N019 N021 0 iGD  ; pins in g s
X§X16 PWMB N019 N015 deadtime params: dt=10n
X§X17 N016 N014 Bx iGD  ; pins in g s
X§X28 N020 N022 0 iGD  ; pins in g s
X§X31 N018 N020 N016 deadtime params: dt=10n
V1 VM 0 {Vdrv}
X§X32 A IA N005 IMON rsns=10u  ; pins n out p
X§X35 B IB N017 IMON rsns=10u  ; pins n out p
A2 PWMB 0 0 0 0 N018 0 0 BUF
X§X37 N012 rpm gain params: G={1/(2*PI)*60}
X§X41 N009 A Ax B Bx N012 torque theta stepper_2ph params: p={p} Rw=1 Lw=2.5m J=5e-5 B=5e-4 N=100 cg1=0.05 cg3=0.015 cg5=0.005
X§X42 VM N001 N005 iNMOS params: esl=1f rsnb=1k csnb=10p ron=10m  ; pins D G S
X§X59 N005 N010 0 iNMOS params: esl=1f rsnb=1k csnb=10p ron=10m  ; pins D G S
X§X60 VM N002 Ax iNMOS params: esl=1f rsnb=1k csnb=10p ron=10m  ; pins D G S
X§X61 Ax N011 0 iNMOS params: esl=1f rsnb=1k csnb=10p ron=10m  ; pins D G S
X§X62 VM N014 Bx iNMOS params: esl=1f rsnb=1k csnb=10p ron=10m  ; pins D G S
X§X63 Bx N022 0 iNMOS params: esl=1f rsnb=1k csnb=10p ron=10m  ; pins D G S
X§X64 VM N013 N017 iNMOS params: esl=1f rsnb=1k csnb=10p ron=10m  ; pins D G S
X§X65 N017 N021 0 iNMOS params: esl=1f rsnb=1k csnb=10p ron=10m  ; pins D G S
X§X47 theta theta_e gain params: G={-p}
X§X12 da PWMA pwm params: tri=0 freq=50k phase=0
X§X13 db PWMB pwm params: tri=0 freq=50k phase=0
X§X14 uα N026 gain params: G={1/(2*Vdrv)}
X§X18 N026 N027 da sum
X§X19 N027 CONST K=0.5  ; pins K
X§X24 uβ N028 gain params: G={1/(2*Vdrv)}
X§X27 N028 N027 db sum
X§X21 IA N023 lpf params: f=5k n=1 q=0.5
X§X30 rpm rpm_ref iq_ref type2_gm params: avol=100k g=0.005 fz1=10 fp1=10k vh=10 vl=-10
X§X20 id id_ref ud type2_gm params: avol=100k g=20 fz1=100 fp1=10k vh={Vdrv} vl={-Vdrv}
X§X5 iq iq_ref uq type2_gm params: avol=100k g=20 fz1=100 fp1=10k vh={Vdrv} vl={-Vdrv}
V2 rpm_ref 0 PWL(0 0 10m 0 +1u 100 100m 100 +1u 400 200m 400 +1u 100)
X§X6 IB N024 lpf params: f=5k n=1 q=0.5

* block symbol definitions
.subckt park alpha beta theta zin d q zout
B1 d 0 V=V(alpha)*cos(V(theta))+V(beta)*sin(V(theta))
B2 q 0 V=-V(alpha)*sin(V(theta))+V(beta)*cos(V(theta))
B3 zout 0 V=V(zin)
* Park Transform
* α
* β
* zero state
* angle(rad)
* zero state
.ends park

.subckt parkinv d q theta zin alpha beta zout
B1 alpha 0 V=V(d)*cos(V(theta))-V(q)*sin(V(theta))
B2 beta 0 V=V(d)*sin(V(theta))+V(q)*cos(V(theta))
B3 zout 0 V=V(zin)
* Inverse Park Transform
* zero state
* angle(rad)
* zero state
.ends parkinv

.subckt deadtime in l h
A1 in 0 0 0 0 0 N002 0 BUF
A2 in 0 0 0 0 0 N001 0 BUF TD={dt}
A3 0 N001 0 N002 0 0 h 0 AND
A4 0 N001 0 N002 0 l 0 0 OR
.param dt=10n
* Deadtime Generator
* deadtime(sec)
* hi-side
* lo-side
* in
* h
* l
* dt
* dt
* 2024-12-29
.ends deadtime

.subckt gain in out
B1 out 0 V={G}*V(in)
.param G=1
* GAIN
* 2024-12-29
.ends gain

.subckt stepper_2ph Tload A Ax B Bx omega Tele theta
Ra N001 A {Rw}
La N001 N002 {Lw}
Rb N005 B {Rw}
Lb N005 N006 {Lw}
B2 N006 Bx V={Kt*cos(p*V(theta))*V(omega)}
B3 Tcog 0 V={cg1*Kt*sin(N*V(theta))+cg3*Kt*sin(3*N*V(theta))+cg5*Kt*sin(5*N*V(theta))}
L§J N004 0 {J}
B5 N003 0 V=V(Tele)-V(Tload)+V(Tcog)
C1 theta 0 1
R§B N004 N003 {B}
B4 0 theta I=V(omega)
B1 N002 Ax V={Kt*sin(p*V(theta))*V(omega)}
B6 Tele 0 V={Kt*I(La)*sin(p*V(theta))+Kt*I(Lb)*cos(p*V(theta))}
B7 omega 0 V=I(J)
.param p=50
.param Rw=1
.param Lw=2.5m
.param J=5e-5
.param B=5e-4
.param Kt=0.4
.param N=100
.param cg1=0.01
.param cg3=0.003
.param cg5=0.001
* Two Phase Hybrid Stepper Motor
* 2025-09-04
.ic V(theta)=0
.ic I(J)=0
* Inertia
* Friction
.ic I(La)=0
.ic I(Lb)=0
* Number of rotor pole pairs
* Widing Resistance (ohm)
* Widing inductance (H)
* Rotor Inertia (kg・m^2)
* Rotor Friction (N・m・s/rad)
* Torque Constant (N・m/A)
* Cogging per rotation (least common multiple of 2*p and number of stator slots)
* 1st harmonic cogging torque ratio  (cogging torque amplitude divided by Kt)
* 3rd harmonic cogging torque ratio  (cogging torque amplitude divided by Kt)
* 5th harmonic cogging torque ratio  (cogging torque amplitude divided by Kt)
* <Revision History>
* 2025-07-19: Initial version
* 2025-09-04:
*   - Fixed mistake ini cogging torque formula.
*   - Replaced all IMON BV source.
*   - Reduced default cogging torque ration.
* Electrical Domain
* Mechanical Domain
.ends stepper_2ph

.subckt pwm duty pwm
R2 c 0 1k
A1 c 0 0 0 0 0 pwm 0 BUF
V1 saw 0 PULSE(0 1 {phase/(360*freq)} {IF(tri==0,1/freq-1n,1/(2*freq))} {IF(tri==0,0.5n,1/(2*freq))} {IF(tri==0,0.5n,0)} {1/freq})
.machine
.state LO 0
.state HI 1
.rule HI LO V(saw)>V(duty)
.rule LO HI V(saw)< V(duty)
.output (c) state
.endmachine
.param freq=100k
.ic V(pwm)=0
.param phase=0
* Pulse Width Modulator
* 2026-09-21
* frequency(Hz)
.param tri=0
* 0: Saw, 1; Triangular
* phase(deg)
* <Revision History>
* 2024-12-29: Initial version
* 2026-09-21: Added tri parameter to select a triangular carrier (tri=1) or retain the original sawtooth carrier (tri=0, default).
.ends pwm

.subckt sum in1 in2 out
B1 OUT 0 V=V(IN1)+V(IN2)
* SUM
* 2024-12-29
.ends sum

.subckt lpf in out
R1 a N001 1k
C1 a 0 {Co}
B1 N001 0 V=V(in)
B2 v0 0 V=V(a)
B3 out 0 V=IF({n}==1,V(v0),V(v1))
R2 v1 0 1Gig
C2 v1 0 1
B5 0 v1 I=V(v2)
R3 v2 0 1Gig
C3 v2 0 1
B4 0 v2 I={-(2*pi*f)*(2*pi*f)*V(v1)-(2*pi*f/q)*V(v2)+(2*pi*f)*(2*pi*f)*V(in)}
* 1st/2nd order Low Pass Filter
* 2025-12-26
.param f=100k
.param n=1
.param q=0.5
.param Co=1/({f}*2k*PI)
* cut off frequency
* filter order (1:1st order, other: 2nd order)
* q factor (only for 2nd order)
* 1st Order LPF
* 2nd Order LPF
* <Revision History>
* 2025-03-23: Initial version
* 2025-12-26:
*  -  Replaced LTspice built in 2ndOrderLPF with discrete circuit to improve convergence.
*  -  Removed output MUX and replaced it with BV.
.ends lpf

.subckt type2_gm fb ref ve
B1 0 ve I=(limit(V(ref)-V(fb),{-Ilim},{Ilim}))
R1 ve N001 {Rz1}
C1 N001 0 {Cz1}
R2 ve 0 {avol}
C2 ve 0 {Co1}
D1 -V ve myD
V1 +V 0 {vh}
V2 -V 0 {vl}
D2 ve +V myD
.param g=1
.param fz1=1k
.param fp1=20k
.param vh=5
.param vl=0
.param avol=100k
* Type 2 Compensator, Gm amp base
* target gain at fz1
* zero frequency(Hz)
* pole frequency(Hz)
* max ouput voltage(V)
* min output voltage(V)
* open loop gain
* 2025-08-31
.param Rz1={(g*avol)/(avol-g)}
.param Cz1={1/(2*PI*fz1*Rz1)}
.param Co1={1/(2*PI*fp1*Rz1)}
.ic V(ve)=0
.MODEL myD D(RON=1u ROFF=1G Vfwd=10n)
.param Ilim=1000
* <Revision History>
* 2025-08-31: Initial version
* feedback
* reference
* * TYPE2_gm is a Gm-amp based version of TYPE2.
* * Unlike the op-amp based TYPE2, it offers high input impedance at ref/fb
* * and is better suited for dynamic reference applications (e.g. soft-start,
* * motor speed control). Both models are kept for flexibility.
.ends type2_gm

.model D D
.lib standard.dio
* Park
* Inverse
* Park
.tran 300m
.options solver="norm"
.options method="gear"
.param p=50
* 2 Phase Stepper Motor, FOC (Field Oriented Control)
* Stepper Motor
* 2025.08.31
* Power Stage
* Torque Control
* Flux Control
;.options debugtran
* Velocity Control
.param Vdrv=24
* FOC Control
* gm
* gm
* gm
.backanno
.end